# EAGLE design Blinker_04 (EAGLE 6.6.0)
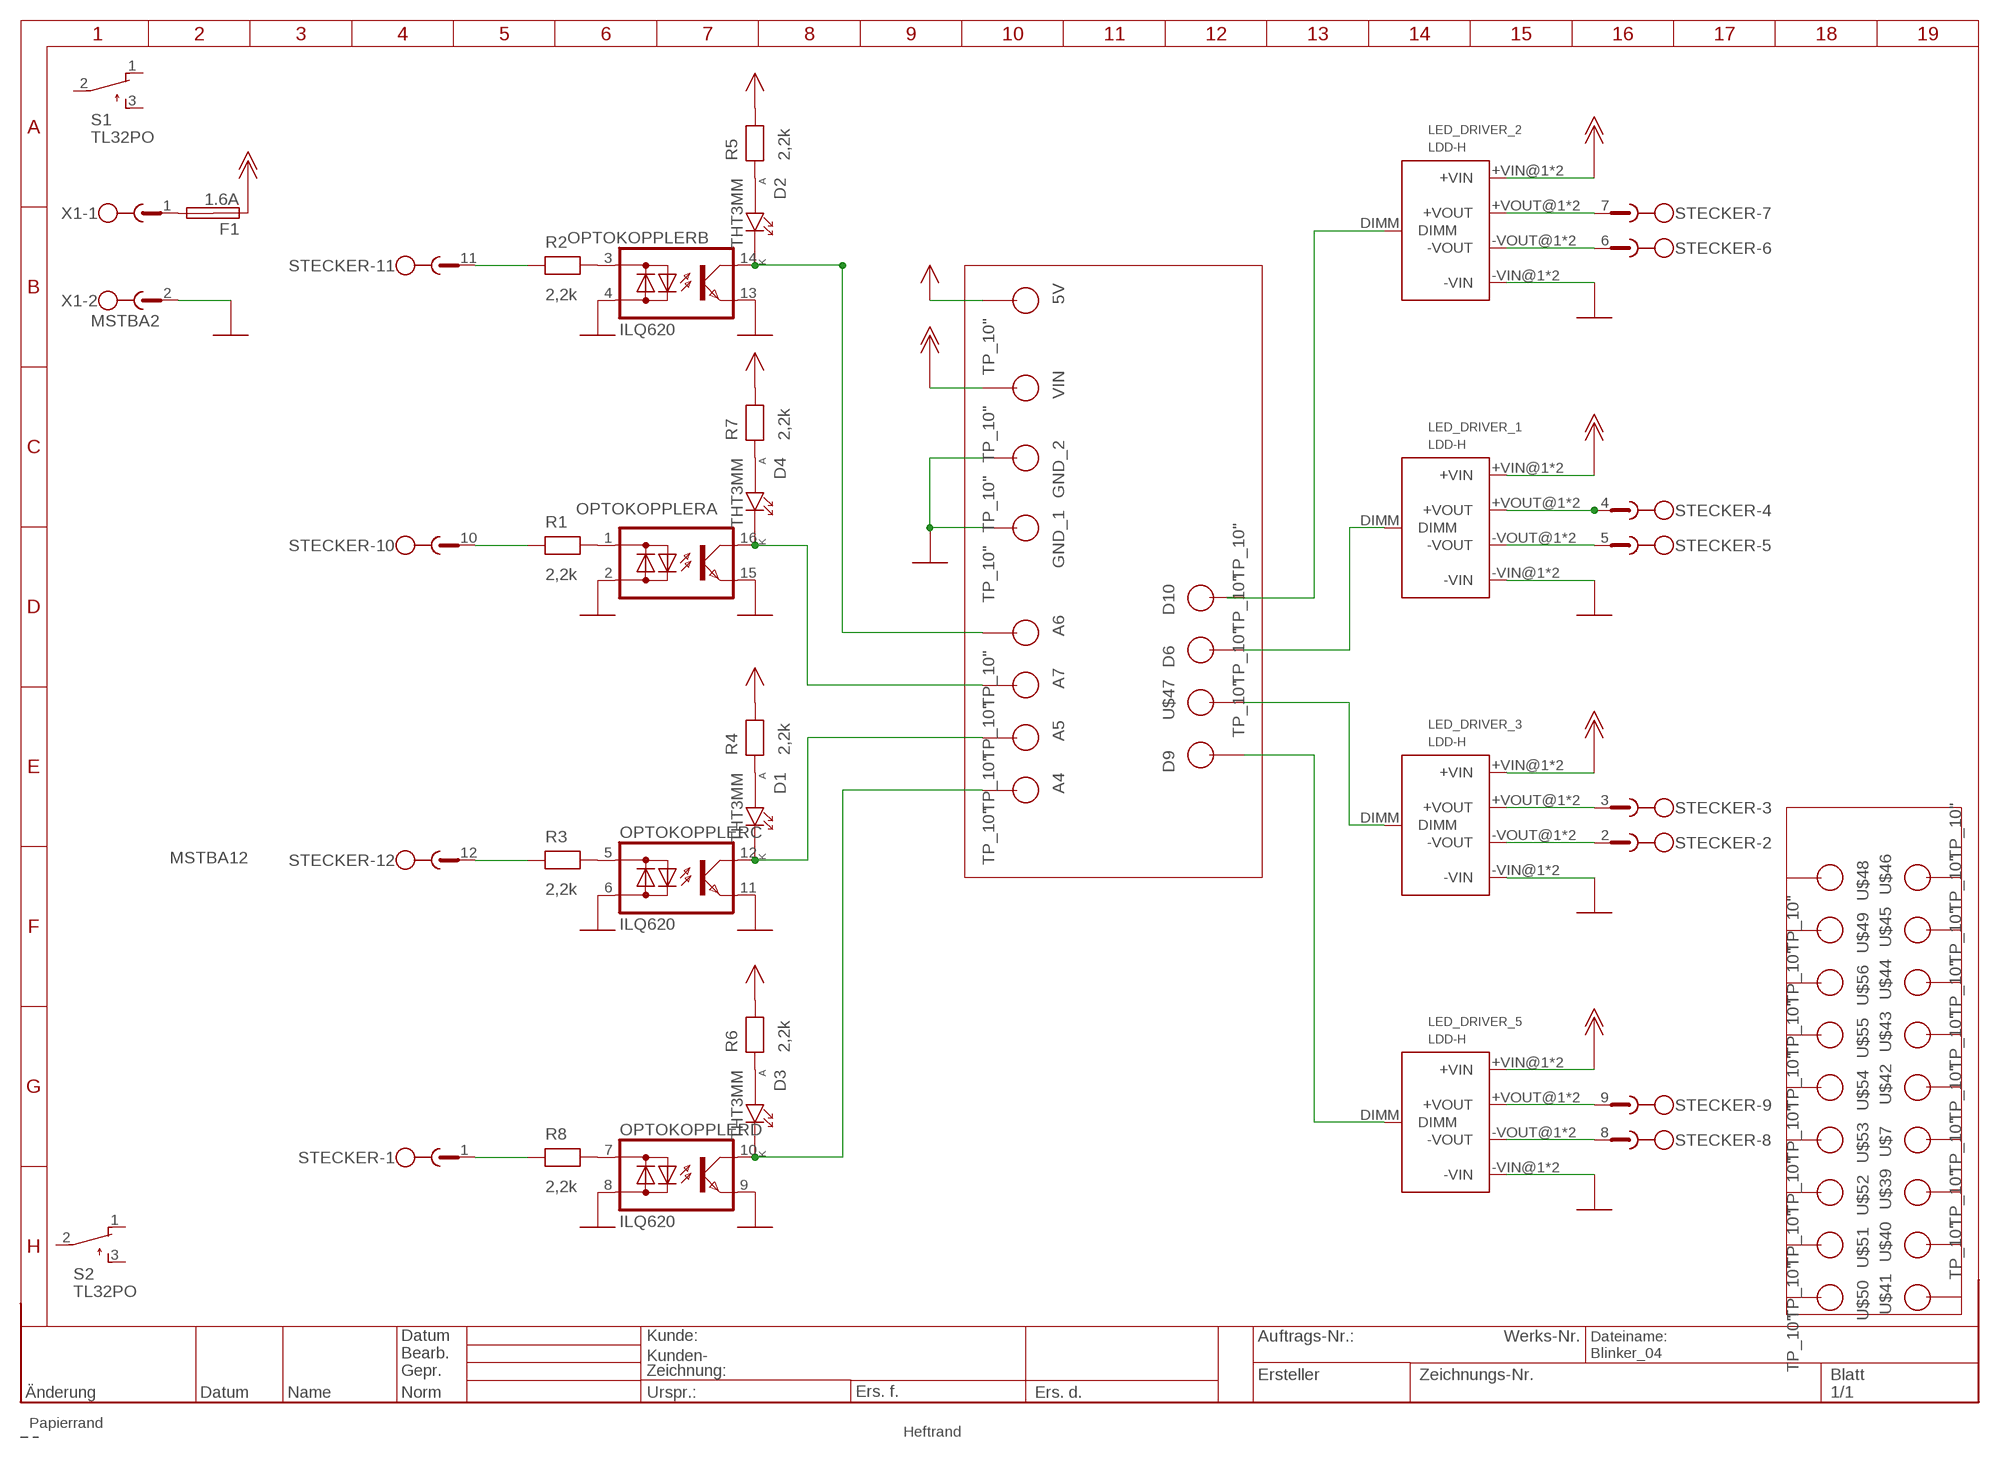
[diagram p0: schematic, sheet 1]

## Parts
5V  TP_10"  [TP_10]
A4  TP_10"  [TP_10]
A5  TP_10"  [TP_10]
A6  TP_10"  [TP_10]
A7  TP_10"  [TP_10]
D1  THT3MM  [THT3MM]
D2  THT3MM  [THT3MM]
D3  THT3MM  [THT3MM]
D4  THT3MM  [THT3MM]
D6  TP_10"  [TP_10]
D9  TP_10"  [TP_10]
D10  TP_10"  [TP_10]
F1  1.6A  SHK20Q  [SHK20Q]
GND_1  TP_10"  [TP_10]
GND_2  TP_10"  [TP_10]
LED_DRIVER_1  LDD-H  [LDD-H]
LED_DRIVER_2  LDD-H  [LDD-H]
LED_DRIVER_3  LDD-H  [LDD-H]
LED_DRIVER_5  LDD-H  [LDD-H]
OPTOKOPPLER  ILQ620  [DIL16]
R1  2,2k  RESEU-10  [R-10]
R2  2,2k  RESEU-10  [R-10]
R3  2,2k  RESEU-10  [R-10]
R4  2,2k  RESEU-10  [R-10]
R5  2,2k  RESEU-10  [R-10]
R6  2,2k  RESEU-10  [R-10]
R7  2,2k  RESEU-10  [R-10]
R8  2,2k  RESEU-10  [R-10]
S1  TL32PO  [TL3XPO]
S2  TL32PO  [TL3XPO]
STECKER  MSTBA12  [MSTBA12]
U$7  TP_10"  [TP_10]
U$39  TP_10"  [TP_10]
U$40  TP_10"  [TP_10]
U$41  TP_10"  [TP_10]
U$42  TP_10"  [TP_10]
U$43  TP_10"  [TP_10]
U$44  TP_10"  [TP_10]
U$45  TP_10"  [TP_10]
U$46  TP_10"  [TP_10]
U$47  TP_10"  [TP_10]
U$48  TP_10"  [TP_10]
U$49  TP_10"  [TP_10]
U$50  TP_10"  [TP_10]
U$51  TP_10"  [TP_10]
U$52  TP_10"  [TP_10]
U$53  TP_10"  [TP_10]
U$54  TP_10"  [TP_10]
U$55  TP_10"  [TP_10]
U$56  TP_10"  [TP_10]
VIN  TP_10"  [TP_10]
X1  MSTBA2  [MSTBA2]

## Nets
+5V: 5V.P$1(TP_13) R4.2 R5.2 R6.2 R7.2
+12V: F1.1A LED_DRIVER_1.+VIN@1(+VIN) LED_DRIVER_1.+VIN@2(+VIN) LED_DRIVER_2.+VIN@1(+VIN) LED_DRIVER_2.+VIN@2(+VIN) LED_DRIVER_3.+VIN@1(+VIN) LED_DRIVER_3.+VIN@2(+VIN) LED_DRIVER_5.+VIN@1(+VIN) LED_DRIVER_5.+VIN@2(+VIN) VIN.P$1(TP_13)
BLAULICHT: LED_DRIVER_1.+VOUT@1(+VOUT) LED_DRIVER_1.+VOUT@2(+VOUT) STECKER.4
GND: GND_1.P$1(TP_13) GND_2.P$1(TP_13) LED_DRIVER_1.-VIN@1(-VIN) LED_DRIVER_1.-VIN@2(-VIN) LED_DRIVER_2.-VIN@1(-VIN) LED_DRIVER_2.-VIN@2(-VIN) LED_DRIVER_3.-VIN@1(-VIN) LED_DRIVER_3.-VIN@2(-VIN) LED_DRIVER_5.-VIN@1(-VIN) LED_DRIVER_5.-VIN@2(-VIN) OPTOKOPPLER.2(A:AC2) OPTOKOPPLER.4(B:AC2) OPTOKOPPLER.6(C:AC2) OPTOKOPPLER.8(D:AC2) OPTOKOPPLER.9(D:E) OPTOKOPPLER.11(C:E) OPTOKOPPLER.13(B:E) OPTOKOPPLER.15(A:E) X1.2
LED_2: D2.A(P1A) R5.1
N$1: F1.2A X1.1
N$2: D4.A(P1A) R7.1
N$3: D6.P$1(TP_13) LED_DRIVER_1.DIMM
N$4: A5.P$1(TP_13) D1.K(P2K) OPTOKOPPLER.12(C:C)
N$5: R8.1 STECKER.1
N$6: OPTOKOPPLER.7(D:AC1) R8.2
N$7: LED_DRIVER_3.DIMM U$47.P$1(TP_13)
N$8: LED_DRIVER_2.DIMM
N$9: D9.P$1(TP_13) LED_DRIVER_5.DIMM
N$10: A4.P$1(TP_13) D3.K(P2K) OPTOKOPPLER.10(D:C)
N$11: R3.1 STECKER.12
N$12: LED_DRIVER_1.-VOUT@1(-VOUT) LED_DRIVER_1.-VOUT@2(-VOUT) STECKER.5
N$14: R2.1 STECKER.11
N$15: LED_DRIVER_3.+VOUT@1(+VOUT) LED_DRIVER_3.+VOUT@2(+VOUT) STECKER.3
N$16: R1.1 STECKER.10
N$18: LED_DRIVER_3.-VOUT@1(-VOUT) LED_DRIVER_3.-VOUT@2(-VOUT) STECKER.2
N$19: LED_DRIVER_5.+VOUT@1(+VOUT) LED_DRIVER_5.+VOUT@2(+VOUT) STECKER.9
N$20: D1.A(P1A) R4.1
N$21: D3.A(P1A) R6.1
N$22: OPTOKOPPLER.5(C:AC1) R3.2
N$23: OPTOKOPPLER.1(A:AC1) R1.2
N$24: OPTOKOPPLER.3(B:AC1) R2.2
N$25: LED_DRIVER_5.-VOUT@1(-VOUT) LED_DRIVER_5.-VOUT@2(-VOUT) STECKER.8
N$26: LED_DRIVER_2.-VOUT@1(-VOUT) LED_DRIVER_2.-VOUT@2(-VOUT) STECKER.6
N$27: LED_DRIVER_2.+VOUT@1(+VOUT) LED_DRIVER_2.+VOUT@2(+VOUT) STECKER.7
SCH_LI_3: A7.P$1(TP_13) D4.K(P2K) OPTOKOPPLER.16(A:C)
SCH_RE_3: A6.P$1(TP_13) D2.K(P2K) OPTOKOPPLER.14(B:C)
Unconnected: D10.P$1(TP_13) F1.1B F1.2B S1.1(O) S1.2(P) S1.3(S) S2.1(O) S2.2(P) S2.3(S) U$7.P$1(TP_13) U$39.P$1(TP_13) U$40.P$1(TP_13) U$41.P$1(TP_13) U$42.P$1(TP_13) U$43.P$1(TP_13) U$44.P$1(TP_13) U$45.P$1(TP_13) U$46.P$1(TP_13) U$48.P$1(TP_13) U$49.P$1(TP_13) U$50.P$1(TP_13) U$51.P$1(TP_13) U$52.P$1(TP_13) U$53.P$1(TP_13) U$54.P$1(TP_13) U$55.P$1(TP_13) U$56.P$1(TP_13)

## Library data of the parts
5V A4-A7 D6 D9 D10 GND_1 GND_2 U$7 U$39-U$56 VIN = SUPPLY:TP_10
D1-D4 = LED:THT3MM
F1 = fuse:SHK20Q: FUSE HOLDER 5 x 20 mm, SH contact, E1207 Buerklin 64G6061; OC_FARNELL: unknown; OC_NEWARK: unknown
LED_DRIVER_1-LED_DRIVER_3 LED_DRIVER_5 = SPEZIAL:LDD-H
OPTOKOPPLER = optocoupler:ILQ620: SIEMENS OPTO COUPLER
R1-R8 = R-C:RESEU-10
S1 S2 = switch:TL32PO: TINY SWITCH ON - MOM Source: http://www2.produktinfo.conrad.com/datenblaetter/700000-724999/705152-da-01-de-Subminiaturschalter_TL_36YO.pdf
STECKER = con-phoenix-508:MSTBA12: PHOENIX; MPN: 1757349; OC_FARNELL: 3705250; OC_NEWARK: 71C4169
X1 = con-phoenix-508:MSTBA2: PHOENIX; MF: FARNELL; MPN: 1757242; OC_FARNELL: 3705171; OC_NEWARK: 71C4161

## Board
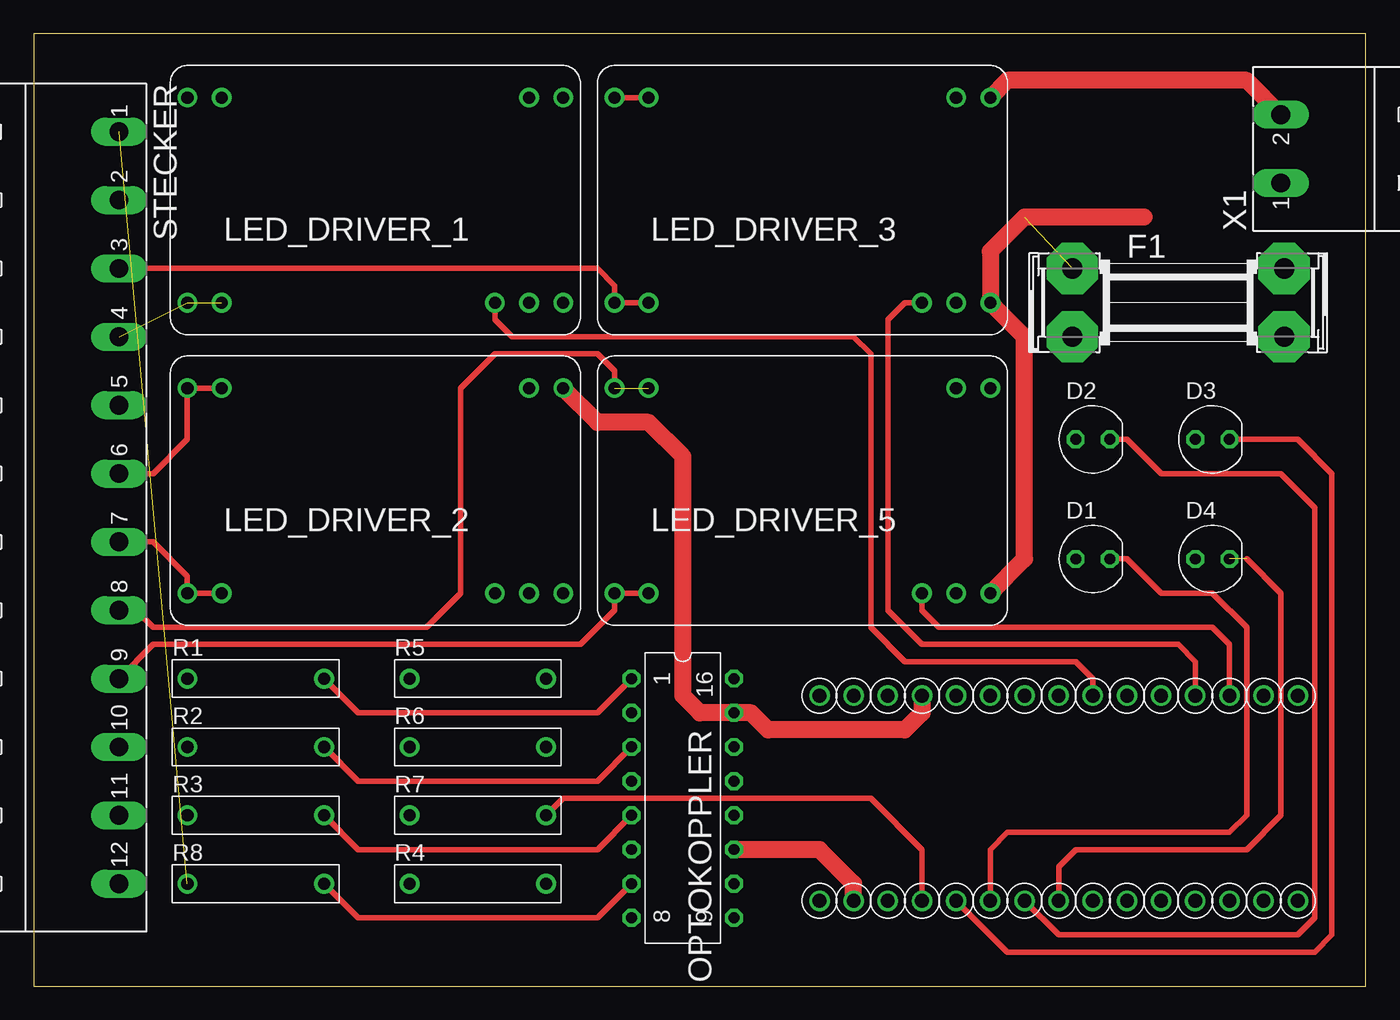
[diagram p1: board, top side]
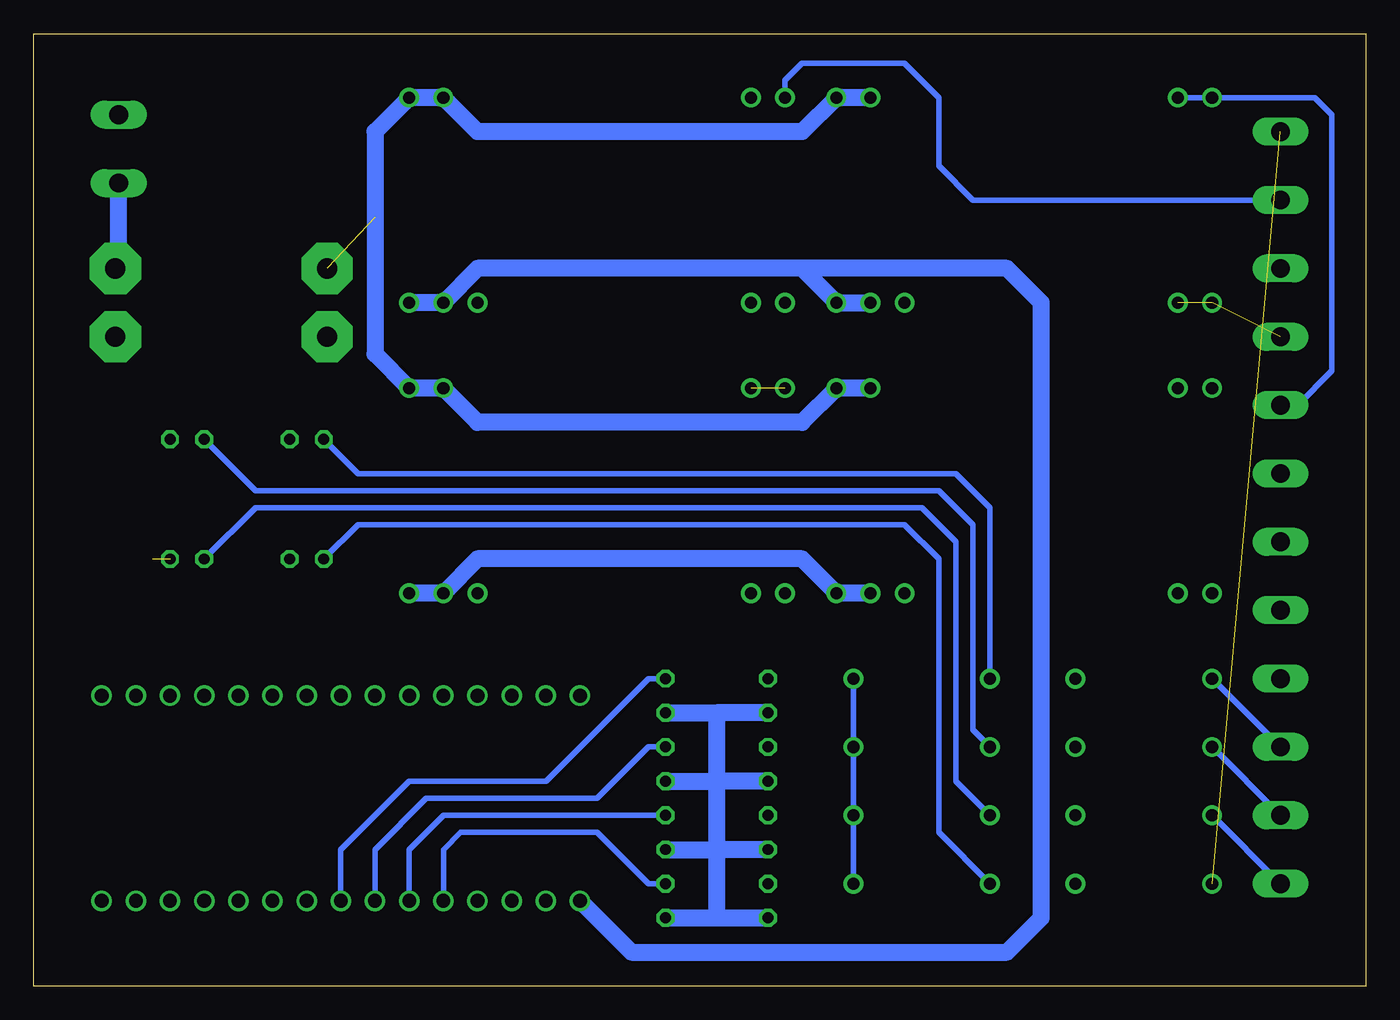
[diagram p2: board, bottom side, seen from below]

Size 99.04 x 70.79 mm. Coordinates in mm from the lower left corner, seen from the top.
Outline: 0,0 99.04,0 99.04,70.79 0,70.79 0,0
Copper layers (1*16): Top 0.035mm / dielectric 1.5mm / Bottom 0.035mm
Design rules "default": minimum track width 10mil, minimum drill 24mil, track to track 8mil, track to pad 8mil, pad to pad 8mil, via to via 8mil, smd to smd 8mil, copper to edge 40mil, drill to drill 8mil, minimum pad ring 10mil, minimum via ring 8mil, stop-mask expansion 4mil, vias tented up to drill 0mil, thermal gap 10mil

### Footprints (pad centres in the part's own frame; a part is rotated, then mirrored left to right if it is on the bottom)
TP_10 = drill 1.016: P$1 0,0
THT3MM = drill 0.813 octagon: A -1.27,0; K 1.27,0
SHK20Q = drill 1.5 pad 3.81 octagon: 1A -7.874,2.54; 1B -7.874,-2.54; 2A 7.874,2.54; 2B 7.874,-2.54
LDD-H = drill 0.9 pad 1.473: +VIN@1 -12.7,7.62; +VIN@2 -10.16,7.62; +VOUT@1 12.7,7.62; +VOUT@2 15.24,7.62; -VIN@1 -12.7,-7.62; -VIN@2 -10.16,-7.62; -VOUT@1 12.7,-7.62; -VOUT@2 15.24,-7.62; DIMM -7.62,7.62
DIL16 = drill 0.813 octagon: 1 -8.89,-3.81; 2 -6.35,-3.81; 3 -3.81,-3.81; 4 -1.27,-3.81; 5 1.27,-3.81; 6 3.81,-3.81; 7 6.35,-3.81; 8 8.89,-3.81; 9 8.89,3.81; 10 6.35,3.81; 11 3.81,3.81; 12 1.27,3.81; 13 -1.27,3.81; 14 -3.81,3.81; 15 -6.35,3.81; 16 -8.89,3.81
R-10 = drill 0.9 pad 1.473: 1 -5.08,0; 2 5.08,0
TL3XPO = drill 1.1 pad 1.422 long: 1 -2.54,0; 2 0,0; 3 2.54,0
MSTBA12 = drill 1.397 long: 1 -27.94,5.08; 2 -22.86,5.08; 3 -17.78,5.08; 4 -12.7,5.08; 5 -7.62,5.08; 6 -2.54,5.08; 7 2.54,5.08; 8 7.62,5.08; 9 12.7,5.08; 10 17.78,5.08; 11 22.86,5.08; 12 27.94,5.08
MSTBA2 = drill 1.397 long: 1 -2.54,5.08; 2 2.54,5.08

### Placement (x,y rotation side)
5V  66.04,6.35 0 top
A4  68.58,6.35 0 top
A5  71.12,6.35 0 top
A6  73.66,6.35 0 top
A7  76.2,6.35 0 top
D1  78.74,31.75 0 top
D2  78.74,40.64 0 top
D3  87.63,40.64 0 top
D4  87.63,31.75 0 top
D6  78.74,21.59 0 top
D9  88.9,21.59 0 top
D10  86.36,6.35 0 top
F1  85.09,50.8 0 top
GND_1  60.96,6.35 0 top
GND_2  66.04,21.59 0 top
LED_DRIVER_1  26.67,58.42 180 top
LED_DRIVER_2  26.67,36.83 180 top
LED_DRIVER_3  58.42,58.42 180 top
LED_DRIVER_5  58.42,36.83 180 top
OPTOKOPPLER  48.26,13.97 270 top
R1  16.51,22.86 0 top
R2  16.51,17.78 0 top
R3  16.51,12.7 0 top
R4  33.02,7.62 0 top
R5  33.02,22.86 0 top
R6  33.02,17.78 0 top
R7  33.02,12.7 0 top
R8  16.51,7.62 0 top
S1  115.57,63.5 90 top  (outside the outline)
S2  127,63.5 90 top  (outside the outline)
STECKER  1.27,35.56 270 top
U$7  93.98,21.59 0 top
U$39  60.96,21.59 0 top
U$40  58.42,21.59 0 top
U$41  91.44,21.59 0 top
U$42  91.44,6.35 0 top
U$43  83.82,6.35 0 top
U$44  81.28,6.35 0 top
U$45  76.2,21.59 0 top
U$46  63.5,21.59 0 top
U$47  86.36,21.59 0 top
U$48  78.74,6.35 0 top
U$49  71.12,21.59 0 top
U$50  63.5,6.35 0 top
U$51  73.66,21.59 0 top
U$52  68.58,21.59 0 top
U$53  83.82,21.59 0 top
U$54  93.98,6.35 0 top
U$55  88.9,6.35 0 top
U$56  81.28,21.59 0 top
VIN  58.42,6.35 0 top
X1  97.79,62.23 90 top

### Tracks (layer width: path | path; a pad name or v marks a point on that pad's centre or on a via)
+5V
  Top 0.406: 5V.P$1 66.04,10.16 62.23,13.97 39.37,13.97 R7.2
  Bottom 0.406: R4.2 R7.2 R6.2 R5.2
+12V  (1 unrouted)
  Top 1.27: 82.55,57.15 73.66,57.15 71.12,54.61 LED_DRIVER_3.+VIN@1 73.66,48.26 73.66,31.75 LED_DRIVER_5.+VIN@1
  Bottom 1.27: LED_DRIVER_2.+VIN@2 LED_DRIVER_2.+VIN@1 41.91,31.75 66.04,31.75 LED_DRIVER_5.+VIN@2 LED_DRIVER_5.+VIN@1 | LED_DRIVER_3.+VIN@1 LED_DRIVER_3.+VIN@2 66.04,53.34 41.91,53.34 | LED_DRIVER_1.+VIN@2 LED_DRIVER_1.+VIN@1 41.91,53.34 | VIN.P$1 54.61,2.54 26.67,2.54 24.13,5.08 24.13,50.8 26.67,53.34 41.91,53.34
BLAULICHT  (2 unrouted)
GND
  Top 1.27: X1.2 90.17,67.31 72.39,67.31 LED_DRIVER_3.-VIN@1 | GND_1.P$1 60.96,7.62 58.42,10.16 OPTOKOPPLER.11 | GND_2.P$1 66.04,20.32 64.77,19.05 54.61,19.05 53.34,20.32 OPTOKOPPLER.15 49.53,20.32 48.26,21.59 48.26,39.37 45.72,41.91 41.91,41.91 LED_DRIVER_2.-VIN@1
  Bottom 1.27: LED_DRIVER_1.-VIN@2 LED_DRIVER_1.-VIN@1 41.91,63.5 66.04,63.5 LED_DRIVER_3.-VIN@2 LED_DRIVER_3.-VIN@1 73.66,63.5 73.66,46.99 LED_DRIVER_5.-VIN@1 LED_DRIVER_5.-VIN@2 66.04,41.91 41.91,41.91 LED_DRIVER_2.-VIN@1 LED_DRIVER_2.-VIN@2 | OPTOKOPPLER.2 48.26,20.32 | 48.26,20.32 48.26,15.24 | 48.26,15.24 48.26,10.16 | 48.26,10.16 48.26,5.08 | 48.26,5.08 OPTOKOPPLER.8 | OPTOKOPPLER.9 48.26,5.08 | OPTOKOPPLER.6 48.26,10.16 | OPTOKOPPLER.11 48.26,10.16 | OPTOKOPPLER.4 48.26,15.24 | OPTOKOPPLER.13 48.26,15.24 | OPTOKOPPLER.15 48.26,20.32
LED_2
  Bottom 0.406: R5.1 27.94,35.56 30.48,38.1 74.93,38.1 D2.A
N$1
  Bottom 1.27: F1.2A 92.71,53.34 X1.1
N$2
  Bottom 0.406: D4.A 82.55,35.56 33.02,35.56 30.48,33.02 30.48,15.24 R7.1
N$3
  Top 0.406: LED_DRIVER_1.DIMM 34.29,49.53 35.56,48.26 60.96,48.26 62.23,46.99 62.23,26.67 64.77,24.13 77.47,24.13 78.74,22.86 D6.P$1
N$4
  Top 0.406: D1.K 81.28,31.75 83.82,29.21 87.63,29.21 90.17,26.67 90.17,12.7 88.9,11.43 72.39,11.43 71.12,10.16 A5.P$1
  Bottom 0.406: A5.P$1 71.12,10.16 68.58,12.7 OPTOKOPPLER.12
N$5  (1 unrouted)
N$6
  Top 0.406: R8.2 24.13,5.08 41.91,5.08 OPTOKOPPLER.7
N$7
  Top 0.406: LED_DRIVER_3.DIMM 64.77,50.8 63.5,49.53 63.5,27.94 66.04,25.4 85.09,25.4 86.36,24.13 U$47.P$1
N$9
  Top 0.406: D9.P$1 88.9,25.4 87.63,26.67 67.31,26.67 66.04,27.94 LED_DRIVER_5.DIMM
N$10
  Top 0.406: A4.P$1 72.39,2.54 95.25,2.54 96.52,3.81 96.52,38.1 93.98,40.64 D3.K
  Bottom 0.406: OPTOKOPPLER.10 53.34,7.62 57.15,11.43 67.31,11.43 68.58,10.16 A4.P$1
N$11
  Bottom 0.406: STECKER.12 R3.1
N$12
  Bottom 0.406: STECKER.5 5.08,43.18 2.54,45.72 2.54,64.77 3.81,66.04 LED_DRIVER_1.-VOUT@2 LED_DRIVER_1.-VOUT@1
N$14
  Bottom 0.406: STECKER.11 R2.1
N$15
  Top 0.406: STECKER.3 41.91,53.34 43.18,52.07 LED_DRIVER_3.+VOUT@2 LED_DRIVER_3.+VOUT@1
N$16
  Bottom 0.406: STECKER.10 R1.1
N$18
  Top 0.406: LED_DRIVER_3.-VOUT@1 LED_DRIVER_3.-VOUT@2
  Bottom 0.406: LED_DRIVER_3.-VOUT@2 43.18,67.31 41.91,68.58 34.29,68.58 31.75,66.04 31.75,60.96 29.21,58.42 STECKER.2
N$19
  Top 0.406: STECKER.9 8.89,25.4 40.64,25.4 43.18,27.94 LED_DRIVER_5.+VOUT@2 LED_DRIVER_5.+VOUT@1
N$20
  Bottom 0.406: D1.A 74.93,34.29 34.29,34.29 31.75,31.75 31.75,11.43 R4.1
N$21
  Bottom 0.406: R6.1 29.21,19.05 29.21,34.29 31.75,36.83 82.55,36.83 D3.A
N$22
  Top 0.406: R3.2 24.13,10.16 41.91,10.16 OPTOKOPPLER.5
N$23
  Top 0.406: R1.2 24.13,20.32 41.91,20.32 OPTOKOPPLER.1
N$24
  Top 0.406: R2.2 24.13,15.24 41.91,15.24 OPTOKOPPLER.3
N$25  (1 unrouted)
  Top 0.406: LED_DRIVER_5.-VOUT@2 43.18,45.72 41.91,46.99 34.29,46.99 31.75,44.45 31.75,29.21 29.21,26.67 8.89,26.67 7.62,27.94 STECKER.8
N$26
  Top 0.406: STECKER.6 8.89,38.1 11.43,40.64 LED_DRIVER_2.-VOUT@2 LED_DRIVER_2.-VOUT@1
N$27
  Top 0.406: LED_DRIVER_2.+VOUT@1 LED_DRIVER_2.+VOUT@2 11.43,30.48 8.89,33.02 STECKER.7
SCH_LI_3  (1 unrouted)
  Top 0.406: 90.17,31.75 92.71,29.21 92.71,12.7 90.17,10.16 77.47,10.16 76.2,8.89 A7.P$1
  Bottom 0.406: A7.P$1 76.2,10.16 71.12,15.24 60.96,15.24 53.34,22.86 OPTOKOPPLER.16
SCH_RE_3
  Top 0.406: D2.K 81.28,40.64 83.82,38.1 92.71,38.1 95.25,35.56 95.25,5.08 93.98,3.81 76.2,3.81 A6.P$1
  Bottom 0.406: A6.P$1 73.66,10.16 69.85,13.97 57.15,13.97 53.34,17.78 OPTOKOPPLER.14